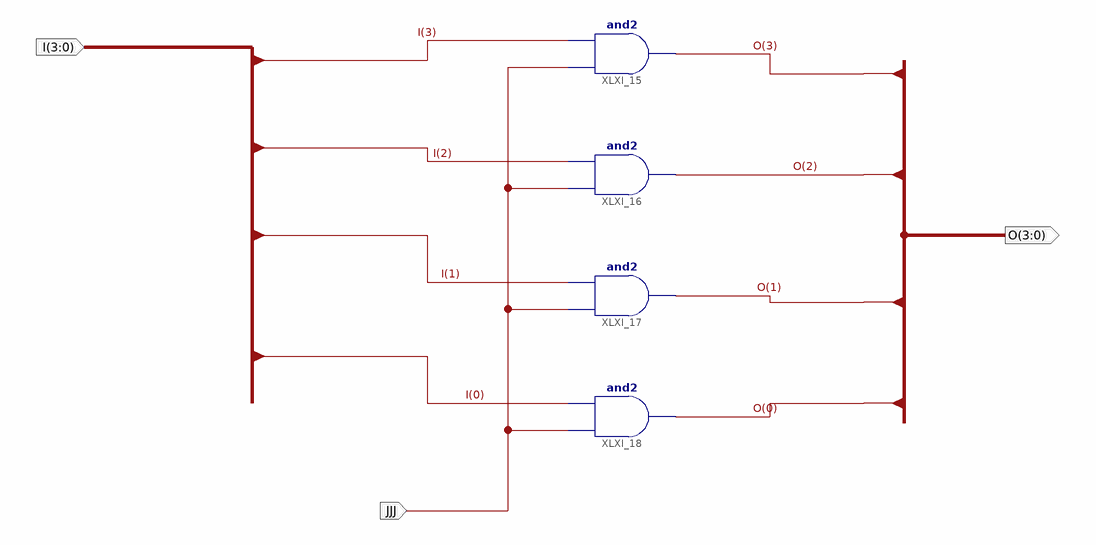
[diagram p0: schematic sheet 1]
// Xilinx ISE schematic I4_tem.sch (spartan3) as structural Verilog: 4 symbols, 3 ports
module I4_tem (
  input  [3:0] I,
  input  JJJ,
  output [3:0] O
);

  and XLXI_15 (O[3], JJJ, I[3]);
  and XLXI_16 (O[2], JJJ, I[2]);
  and XLXI_17 (O[1], JJJ, I[1]);
  and XLXI_18 (O[0], JJJ, I[0]);
endmodule
